# EasyEDA Pro project USB.epro

# Schematic Schematic1
Board Name: Board1; Create Date: 2026-05-29; Page Name: P1; Project Name: USB HUB; Schematic Name: Schematic1; Update Date: 2026-05-29; Company: EasyEDA.com; Page Size: A4; Version: V1.0
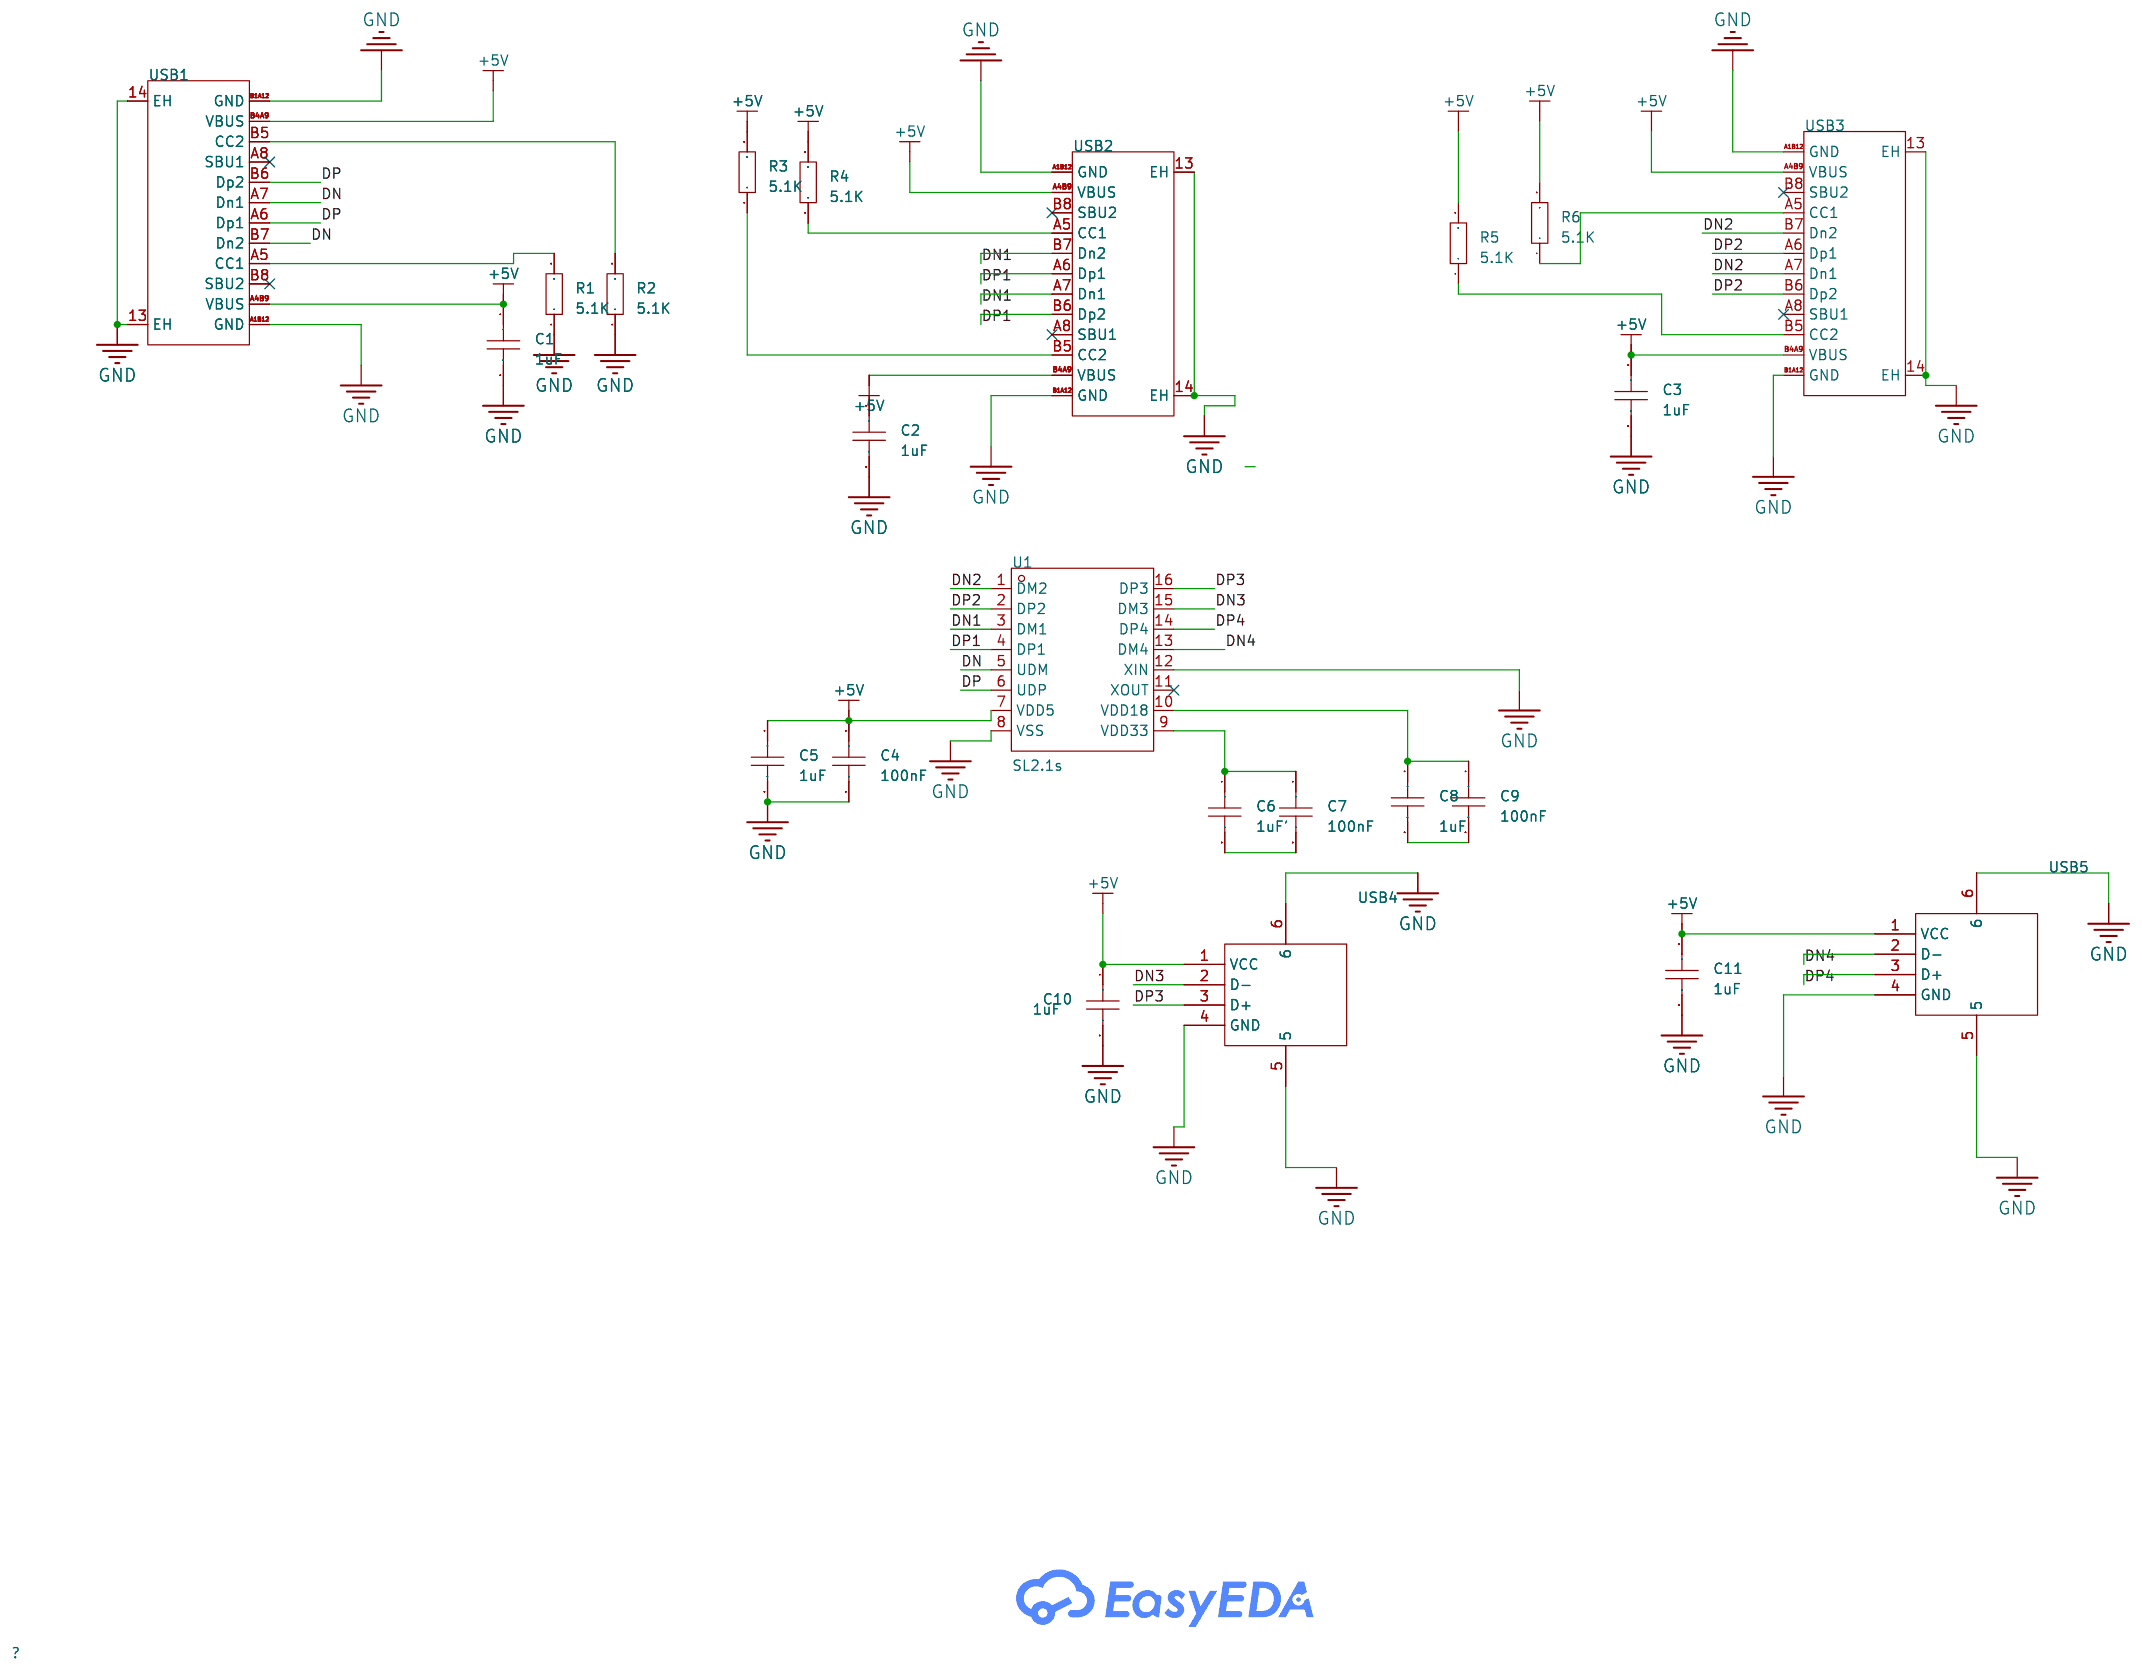
[diagram p0: schematic sheet]

## Parts
C1  1uF  [C0603]
C2  1uF  [C0603]
C3  1uF  [C0603]
C4  100nF  [C0603]
C5  1uF  [C0603]
C6  1uF'  [C0603]
C7  100nF  [C0603]
C8  1uF  [C0603]
C9  100nF  [C0603]
C10  1uF  [C0603]
C11  1uF  [C0603]
R1  5.1K  [R0603]
R2  5.1K  [R0603]
R3  5.1K  [R0603]
R4  5.1K  [R0603]
R5  5.1K  [R0603]
R6  5.1K  [R0603]
U1  SL2.1s  [SSOP-16_L4.6-W2.6-P0.53-LS4.0-BL]
USB1  TYPE-C 16PIN 2MD(073)  [USB-C-SMD_TYPE-C-16PIN-2MD-073]
USB2  TYPE-C 16PIN 2MD(073)  [USB-C-SMD_TYPE-C-16PIN-2MD-073]
USB3  TYPE-C 16PIN 2MD(073)  [USB-C-SMD_TYPE-C-16PIN-2MD-073]
USB4  10.0 QHHTZB6.3  [USB-A-TH_10.0QHHTZB6.3]
USB5  10.0 QHHTZB6.3  [USB-A-TH_10.0QHHTZB6.3]

## Library data of the parts
C1-C11 = CAP_0603: Supplier Footprint: 0603
R1-R6 = Res_0603: Supplier Footprint: 0603
U1 = SL2.1s: type:Hub USB Protocol:USB 2.0 Data Rate:- Voltage - Supply:4V~5.25V Voltage - Supply:4V~5.25V Operating Temperature:0℃~+70℃ Operating Temperature:0℃~+70℃ Memory Interface:- Current - Supply:120mA Quiescent Supply Current:2.5mA Number of Channels:4; LCSC Part Name: USB2.0 HUB控制器集成电路; Supplier Part: C2684433; Manufacturer: CoreChips(和芯润德); Supplier Footprint: SSOP-16; JLCPCB Part Class: Extended Part; Datasheet: https://item.szlcsc.com/datasheet/SL2.1s/2782346.html; Supplier: LCSC; type: Hub; USB Protocol: USB 2.0; Voltage - Supply: 4V~5.25V; Operating Temperature: 0℃~+70℃; Current - Supply: 120mA; Quiescent Supply Current: 2.5mA; Number of Channels: 4
USB1-USB3 = TYPE-C 16PIN 2MD(073): Connector Type:Type-C Protocol Standard:- Gender:Female Mounting Type:Surface Mount, Right Angle Number of Contacts:16P Number of Ports:1 Current Rating-Power:3A Voltage Rating:5V Connect-Disconnect Life:10,000 Cycles Supplementary Features:- Center Heigh; LCSC Part Name: Type-C 母 卧贴; Supplier Part: C2765186; Manufacturer: SHOU HAN(首韩); Supplier Footprint: SMD; JLCPCB Part Class: Extended Part; Datasheet: https://item.szlcsc.com/datasheet/TYPE-C%252016PIN%25202MD(073)/2901843.html; Supplier: LCSC; Connector Type: Type-C; Gender: Female; Mounting Type: Surface Mount, Right Angle; Number of Contacts: 16P; Number of Ports: 1; Current Rating-Power: 3A; Voltage Rating: 5V; Connect-Disconnect Life: 10,000 Cycles; Detection color: Black; Operating Temperature: -25℃~+85℃
USB4 USB5 = 10.0 QHHTZB6.3: Connector Type:Type-A Protocol Standard:USB 2.0 Gender:Female Mounting Type:Surface Mount, Right Angle Number of Contacts:4P Number of Ports:1 Current Rating-Power:1.5A Voltage Rating:30V Connect-Disconnect Life:5,000 times Supplementary Features:- Center; LCSC Part Name: 壳长10.0mm; Supplier Part: C668591; Manufacturer: SHOU HAN(首韩); Supplier Footprint: SMD; JLCPCB Part Class: Extended Part; Datasheet: https://item.szlcsc.com/datasheet/10.0%2520QHHTZB6.3/698534.html; Supplier: LCSC; Connector Type: Type-A; Protocol Standard: USB 2.0; Gender: Female; Mounting Type: Surface Mount, Right Angle; Number of Contacts: 4P; Number of Ports: 1; Current Rating-Power: 1.5A; Voltage Rating: 30V; Connect-Disconnect Life: 5,000 times; Length: 10mm; Detection color: Black; Operating Temperature: -25℃~+85℃

## Nets
+5V: C1.1 C3.1 C4.1 C5.1 C10.1 C11.1 R3.2 R4.2 R5.2 R6.2 U1.7(VDD5) USB1.A4B9(VBUS) USB1.B4A9(VBUS) USB2.A4B9(VBUS) USB2.B4A9(VBUS) USB3.A4B9(VBUS) USB3.B4A9(VBUS) USB4.1(VCC) USB5.1(VCC)
GND: C1.2 C2.2 C3.2 C4.2 C5.2 C10.2 C11.2 R1.1 R2.1 U1.8(VSS) U1.12(XIN) USB1.13(EH) USB1.14(EH) USB1.A1B12(GND) USB1.B1A12(GND) USB2.13(EH) USB2.14(EH) USB2.A1B12(GND) USB2.B1A12(GND) USB3.13(EH) USB3.14(EH) USB3.A1B12(GND) USB3.B1A12(GND) USB4.4(GND) USB4.5 USB4.6 USB5.4(GND) USB5.5 USB5.6
DN: U1.5(UDM) USB1.A7(Dn1) USB1.B7(Dn2)
DN1: U1.3(DM1) USB2.A7(Dn1) USB2.B7(Dn2)
DN2: U1.1(DM2) USB3.A7(Dn1) USB3.B7(Dn2)
DN3: U1.15(DM3) USB4.2(D-)
DN4: U1.13(DM4) USB5.2(D-)
DP: U1.6(UDP) USB1.A6(Dp1) USB1.B6(Dp2)
DP1: U1.4(DP1) USB2.A6(Dp1) USB2.B6(Dp2)
DP2: U1.2(DP2) USB3.A6(Dp1) USB3.B6(Dp2)
DP3: U1.16(DP3) USB4.3(D+)
DP4: U1.14(DP4) USB5.3(D+)
$1N1224: R1.2 USB1.A5(CC1)
$1N1230: R2.2 USB1.B5(CC2)
$1N2495: R3.1 USB2.B5(CC2)
$1N2534: R4.1 USB2.A5(CC1)
$1N2610: R5.1 USB3.B5(CC2)
$1N2620: R6.1 USB3.A5(CC1)
$1N3069: C6.1 C7.1 U1.9(VDD33)
$1N3075: C8.1 C9.1 U1.10(VDD18)
$1N3204: C8.2 C9.2
$1N3208: C6.2 C7.2

Not connected (* = marked no-connect by the designer): C2 1; U1 11(XOUT)*; USB1 A8(SBU1)* B8(SBU2)*; USB2 A8(SBU1)* B8(SBU2)*; USB3 A8(SBU1)* B8(SBU2)*

# Board PCB1
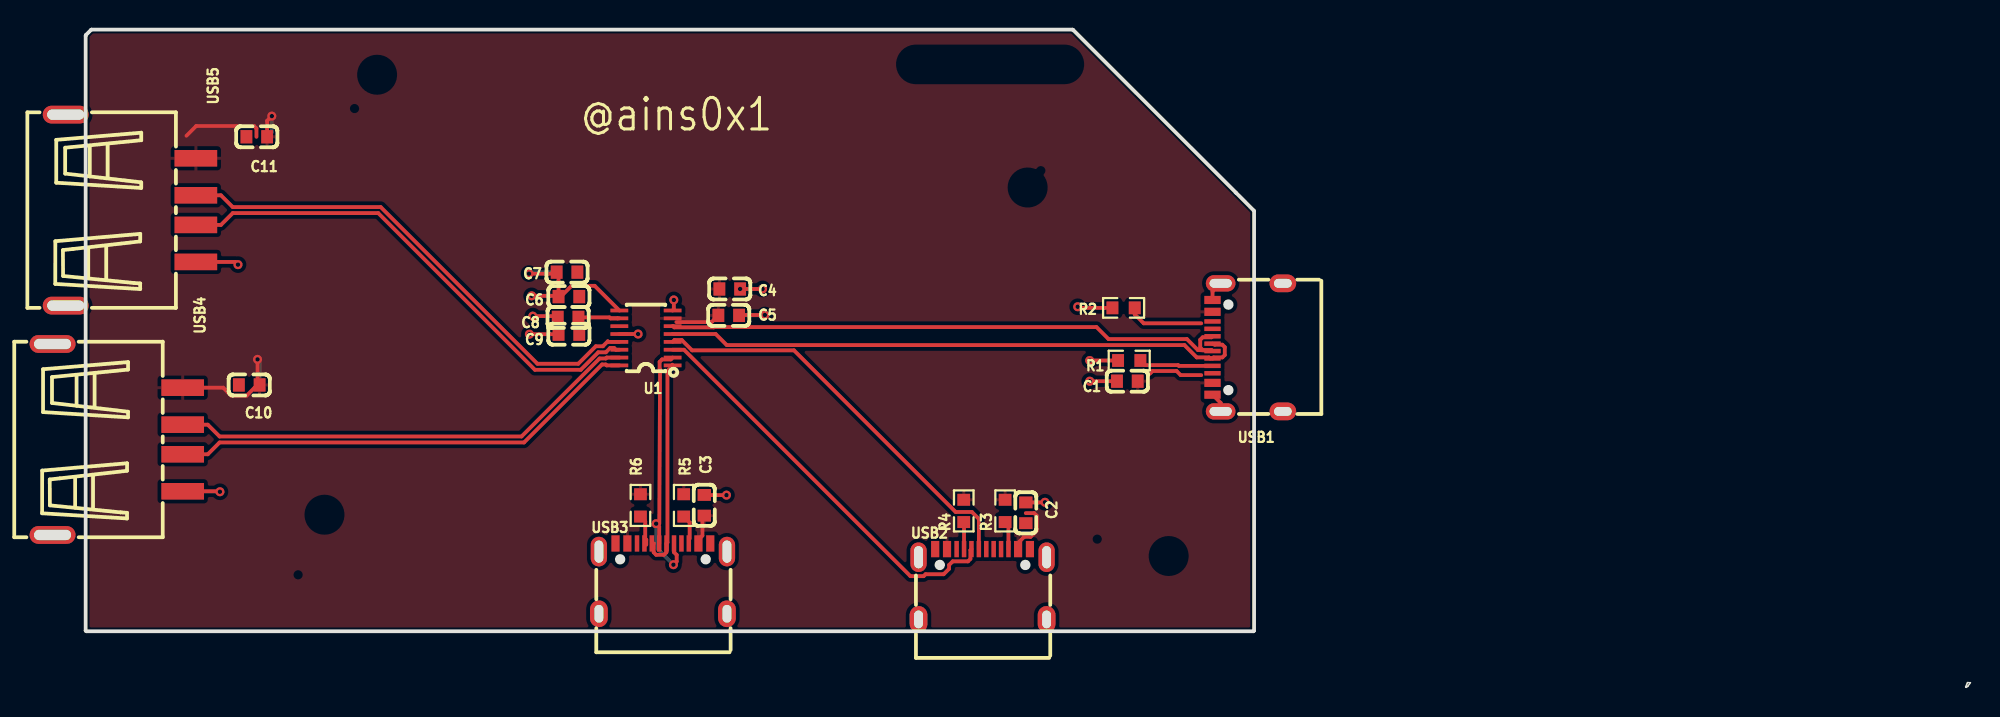
[diagram p1: board, top side]
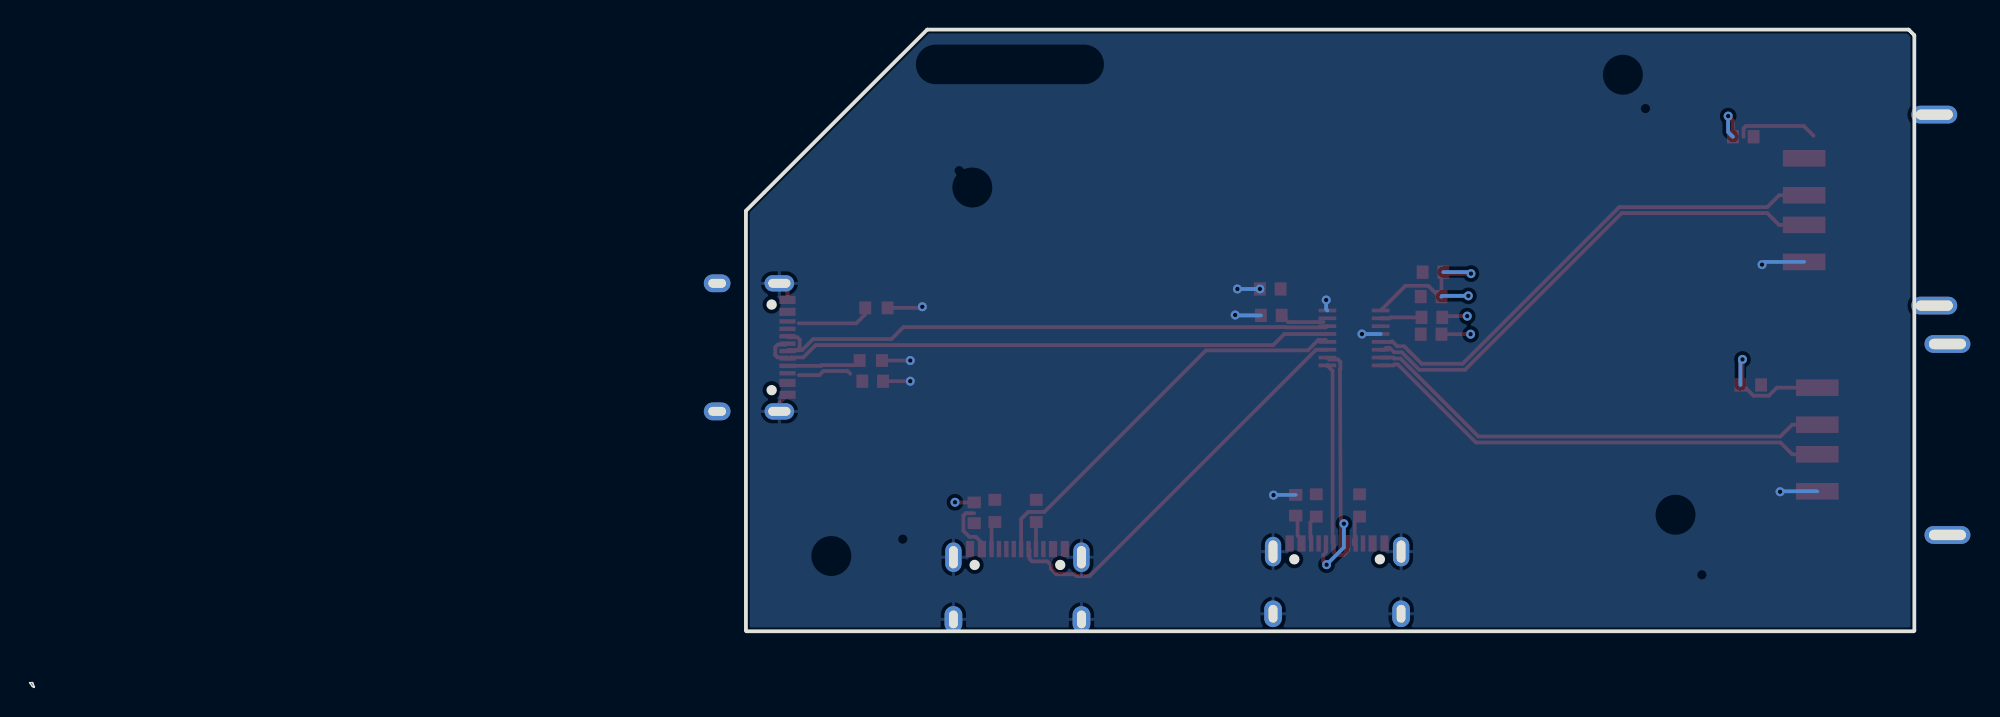
[diagram p2: board, bottom side, seen from below]

Outline 127.3 x 44.43 mm; copper layers: Top Layer, Bottom Layer. Coordinates in mm from the lower left corner of the outline.
Outline path: 0,44.03 0,3.85 arc(0.01,3.81) 0.05,3.79 78.87,3.79 arc(78.9,3.81) 78.92,3.85 78.92,32.17 arc(78.91,32.19) 78.9,32.21 77.68,33.43 66.69,44.42 arc(66.67,44.43) 66.65,44.43 0.4,44.43 arc(0.38,44.43) 0.37,44.42 0.02,44.07 arc(0,44.05) 0,44.03 ; 126.98,0.04 arc(127.01,0.13) 127.05,0.21 arc(127.08,0.27) 127.1,0.33 arc(127.2,0.32) 127.3,0.32 arc(127.22,0.2) 127.14,0.09 arc(127.08,0.04) 127.02,0 arc(126.99,0.01) 126.98,0.04
Stack: Top Layer 0.035mm / Dielectric1 1.51mm FR4 er 4.5 / Bottom Layer 0.035mm

## Design rules (mm)
net DN: DP1
net DP: DP1
net DP4: DP2
net DN4: DP2
net DP3: DP3
net DN3: DP3
template: Custom Config
spacing copperThickness1oz (default): track to track 0.102, other pairs 0.152 to 0.3
spacing copperThickness2oz: track to track 0.203, other pairs 0.152 to 0.3
track width copperThickness1oz (default): min 0.127, default 0.254, max 2.54
track width copperThickness2oz: min 0.203, default 0.254, max 2.54
differential pair differentialPair (default): width min 0.127, default 0.254, max 2.54; gap min 0.152, default 0.152
via viaSize (default): diameter min 0.5, default 0.61, max 10; hole min 0.3, default 0.305, max 6.3

## Placement (name value [footprint] x y rotation side)
C1  1uF  [C0603]  70.36 20.69 180 top
C2  1uF  [C0603]  63.5 11.8 270 top
C3  1uF  [C0603]  41.78 12.3 90 top
C4  100nF  [C0603]  43.5 26.92 0 top
C5  1uF  [C0603]  43.43 25.13 0 top
C6  1uF'  [C0603]  32.64 26.4 0 top
C7  100nF  [C0603]  32.51 28.05 0 top
C8  1uF  [C0603]  32.59 24.99 180 top
C9  100nF  [C0603]  32.64 23.86 180 top
C10  1uF  [C0603]  11.05 20.43 180 top
C11  1uF  [C0603]  11.56 37.2 180 top
R1  5.1K  [R0603]  70.49 22.08 0 top
R2  5.1K  [R0603]  70.1 25.64 0 top
R3  5.1K  [R0603]  62.1 11.92 90 top
R4  5.1K  [R0603]  59.31 11.92 90 top
R5  5.1K  [R0603]  40.39 12.29 90 top
R6  5.1K  [R0603]  37.47 12.29 90 top
U1  SL2.1s  [SSOP-16_L4.6-W2.6-P0.53-LS4.0-BL]  37.85 23.61 90 top
USB1  TYPE-C 16PIN 2MD(073)  [USB-C-SMD_TYPE-C-16PIN-2MD-073]  78.49 22.97 90 top
USB2  TYPE-C 16PIN 2MD(073)  [USB-C-SMD_TYPE-C-16PIN-2MD-073]  60.58 6.97 0 top
USB3  TYPE-C 16PIN 2MD(073)  [USB-C-SMD_TYPE-C-16PIN-2MD-073]  38.99 7.35 0 top
USB4  10.0 QHHTZB6.3  [USB-A-TH_10.0QHHTZB6.3]  2.16 16.75 270 top
USB5  10.0 QHHTZB6.3  [USB-A-TH_10.0QHHTZB6.3]  3.05 32.24 270 top

## Footprints (pads in the part's own frame, mm; a bottom-side part is the same pattern mirrored in y, then rotated)
C0603
  rect 0.8x0.9 smd: 1(-0.7,0) 2(0.7,0)
R0603
  rect 0.806x0.864 smd: 1(-0.753,0) 2(0.753,0)
SSOP-16_L4.6-W2.6-P0.53-LS4.0-BL
  rect 0.25x1.2 smd: 1(-1.855,-1.8) 2(-1.325,-1.8) 3(-0.795,-1.8) 4(-0.265,-1.8) 5(0.265,-1.8) 6(0.795,-1.8) 7(1.325,-1.8) 8(1.855,-1.8) 9(1.855,1.8) 10(1.325,1.8) 11(0.795,1.8) 12(0.265,1.8) 13(-0.265,1.8) 14(-0.795,1.8) 15(-1.325,1.8) 16(-1.855,1.8)
USB-A-TH_10.0QHHTZB6.3
  rect 1.12x2.88 smd: 1(-3.5,4.395) 2(-1,4.395) 3(1,4.395) 4(3.5,4.395)
  oval 1.2x3.1 hole 0.7x2.5: 5(-6.45,-4.395) 6(6.45,-4.395)
USB-C-SMD_TYPE-C-16PIN-2MD-073
  oval 1.1x2 hole 0.6x1.5: 13(-4.325,1.825) 14(4.325,1.825)
  oval 1.2x1.8 hole 0.6x1.2: 13(-4.325,-2.375) 14(4.325,-2.375)
  rect 0.55x1.1 smd: A1B12(-3.2,2.375) A4B9(-2.4,2.375) B1A12(3.2,2.375) B4A9(2.4,2.375)
  rect 0.3x1.1 smd: A5(-1.25,2.375) A6(-0.25,2.375) A7(0.25,2.375) A8(1.25,2.375) B5(1.75,2.375) B6(0.75,2.375) B7(-0.75,2.375) B8(-1.75,2.375)

## Nets
As in the schematic.

Pads without a net: C2 1; U1 11; USB1 A8 B8; USB2 A8 B8; USB3 A8 B8

## Via types
v1: diameter 0.61, hole 0.305, Top Layer to Bottom Layer, 20 vias

## Routing (per net, layer and track width the routed paths; a pad name or vN(x,y) marks a point on that pad's centre or on a via; arc(x,y) is an arc through that point)
+5V: length 26.5
  Top Layer w0.254: C5.1 42.28,24.67 39.9,24.67 ; USB4.1 9.29,20.24 9.83,19.7 10.86,19.7 11.41,20.24 11.57,20.24 C10.1 11.61,20.57 v1(11.61,22.15) ; 63.5,11.77 64.07,11.77 64.23,11.61 64.23,10.58 63.82,10.17 63.39,10.17 62.98,9.76 USB2.B4A9 ; C11.1 12.26,38.27 v1(12.57,38.59) ; 41.66,11.6 41.66,10.25 41.45,10.04 ; 11.54,37.19 11.54,37.76 11.37,37.92 7.47,37.92 6.81,37.26
  Bottom Layer w0.254: C11.1 12.57,37.51 v1(12.57,38.59) ; v1(11.61,22.15) 11.75,22.01 C10.1
GND: length 33.3
  Top Layer w0.254: USB1.13 76.66,19.22 USB1.A1B12 ; USB4.4 9.04,13.24 v1(9.07,13.21) ; v1(37.31,23.87) U1.12 ; C3.2 41.8,12.99 v1(43.28,12.99) ; v1(45.87,25.15) 44.16,25.15 C5.2 ; v1(10.29,28.56) 10.1,28.74 USB5.4 ; R2.1 67.08,25.63 v1(67.01,25.71) ; C1.2 v1(67.82,20.68) ; USB1.14 76.11,26.74 USB1.B1A12 ; v1(39.73,26.17) 39.73,25.54 U1.8 ; R1.1 v1(67.82,22.08) ; v1(45.72,26.91) v1(44.2,26.91)
  Bottom Layer w0.254: v1(39.73,26.17) 39.73,25.54 U1.8 ; v1(44.2,26.91) v1(45.72,26.91) ; v1(43.28,12.99) 43.27,13 C3.2 ; USB4.4 9.04,13.24 v1(9.07,13.21) ; C5.2 45.85,25.13 v1(45.87,25.15) ; USB5.4 10.1,28.74 v1(10.29,28.56) ; U1.12 v1(37.31,23.87)
(no net): length 5
  Top Layer w0.254: 71.88,21.19 72.06,21.37 73.68,21.37 73.96,21.09 75.35,21.09 ; v1(64.8,12.5) 64.78,12.49 C2.1
DN: length 39.5
  Top Layer w0.254: USB1.A7 76.13,23.2 76.21,23.2 76.26,23.15 76.78,23.15 76.94,22.99 76.94,22.46 76.78,22.29 76.18,22.29 USB1.B7 75.94,22.22 75.87,22.29 75.04,22.29 74.21,23.12 43.3,23.12 42.55,23.87 U1.5
DN1: length 27.8
  Top Layer w0.254: U1.3 40.41,22.81 55.71,7.52 56.6,7.52 56.73,7.65 57.95,7.65 58.32,8.01 58.32,8.27 58.56,8.52 59.6,8.52 59.76,8.68 59.76,9.27 USB2.B7
DN2: length 14.5
  Top Layer w0.254: 39.62,21.8 39.62,21.71 39.3,21.39 39.3,9.79 39.22,9.72 39.22,9.12 39.06,8.96 38.53,8.96 38.37,9.12 38.37,9.72 38.3,9.79
DN3: length 32
  Top Layer w0.254: USB4.2 8.25,17.74 9.05,16.95 29.44,16.95 34.71,22.22 35.13,22.22 35.19,22.28 U1.15
DN4: length 34
  Top Layer w0.254: U1.13 35.3,23.34 35.26,23.38 34.93,23.04 34.45,23.04 33.27,21.86 30.51,21.86 19.93,32.45 9.93,32.45 9.14,33.24 USB5.2
DP: length 39.5
  Top Layer w0.254: USB1.B6 76.04,23.65 75.45,23.65 75.28,23.48 75.28,22.95 75.45,22.79 76.04,22.79 USB1.A6 75.12,22.79 74.38,23.53 69.09,23.53 68.28,24.34 42.45,24.34 42.43,24.32 39.75,24.32 39.67,24.4 U1.6
DP1: length 27.8
  Top Layer w0.254: USB2.A6 60.33,11.38 59.86,11.85 58.76,11.85 47.84,22.77 40.96,22.77 40.26,23.47 39.77,23.47 U1.4
DP2: length 18.2
  Top Layer w0.254: USB3.A6 38.74,10.85 v1(38.53,11.06) ; U1.2 39.52,22.15 38.93,22.15 38.77,21.99 38.77,21.51 38.8,21.48 38.75,11.05 ; USB3.B6 39.74,9.13 39.92,8.95 39.92,8.5 v1(39.7,8.29)
  Bottom Layer w0.254: v1(38.53,11.06) 38.53,9.45 v1(39.7,8.29)
DP3: length 32
  Top Layer w0.254: USB4.3 8.25,15.74 9.05,16.54 29.61,16.54 34.88,21.81 35.13,21.81 35.19,21.75 U1.16
DP4: length 34
  Top Layer w0.254: U1.14 35.81,22.81 35.69,22.93 35.43,22.93 35.14,22.64 34.62,22.64 33.44,21.46 30.35,21.46 19.76,32.04 9.93,32.04 9.14,31.24 USB5.3
$1N1224: length 4.5
  Top Layer w0.254: 75.6,21.72 73.84,21.72 73.79,21.77 71.55,21.77 R1.2
$1N1230: length 5.2
  Top Layer w0.254: R2.2 70.86,25.2 71.46,24.59 75.35,24.59
$1N2495: length 1.9
  Top Layer w0.254: R3.1 62.33,10.94 USB2.B5
$1N2534: length 1.8
  Top Layer w0.254: R4.1 59.33,11.15 USB2.A5
$1N2610: length 1.7
  Top Layer w0.254: R5.1 40.8,11.14 40.8,10.04
$1N2620: length 2.1
  Top Layer w0.254: 37.87,9.64 37.87,9.97 37.8,10.04 37.8,11.22 R6.1
$1N3069: length 14.3
  Top Layer w0.254: 31.94,26.4 31.89,26.45 v1(30.12,26.45) ; 31.94,26.4 31.94,27.92 C7.1 31.71,27.95 v1(29.95,27.95) ; 31.94,26.4 32.09,26.4 32.82,27.13 34.38,27.13 U1.9
  Bottom Layer w0.254: C7.1 30.05,28.05 v1(29.95,27.95) ; 31.94,26.4 31.89,26.45 v1(30.12,26.45)
$1N3075: length 2.8
  Top Layer w0.254: 33.29,24.99 35.38,24.99 35.45,24.93 35.93,24.93 35.93,24.93 U1.10
$1N3204: length 3.7
  Top Layer w0.254: v1(30.2,25.08) 31.8,25.08 C8.2 ; 31.94,23.86 v1(29.97,23.86)

## Copper pours and planes (outline as drawn; the poured copper is in the pictures)
+5V on Top Layer: -9.27,46.85 87.63,46.85 87.63,-3.44 -9.27,-3.44
GND on Bottom Layer: -1.9,48.12 83.82,48.12 83.82,-4.33 -1.9,-4.33

## Text on the board
Top Silkscreen Layer: @ains0x1
